# Altium schematic sheet [4] Temp_Sense.SchDoc
size A4
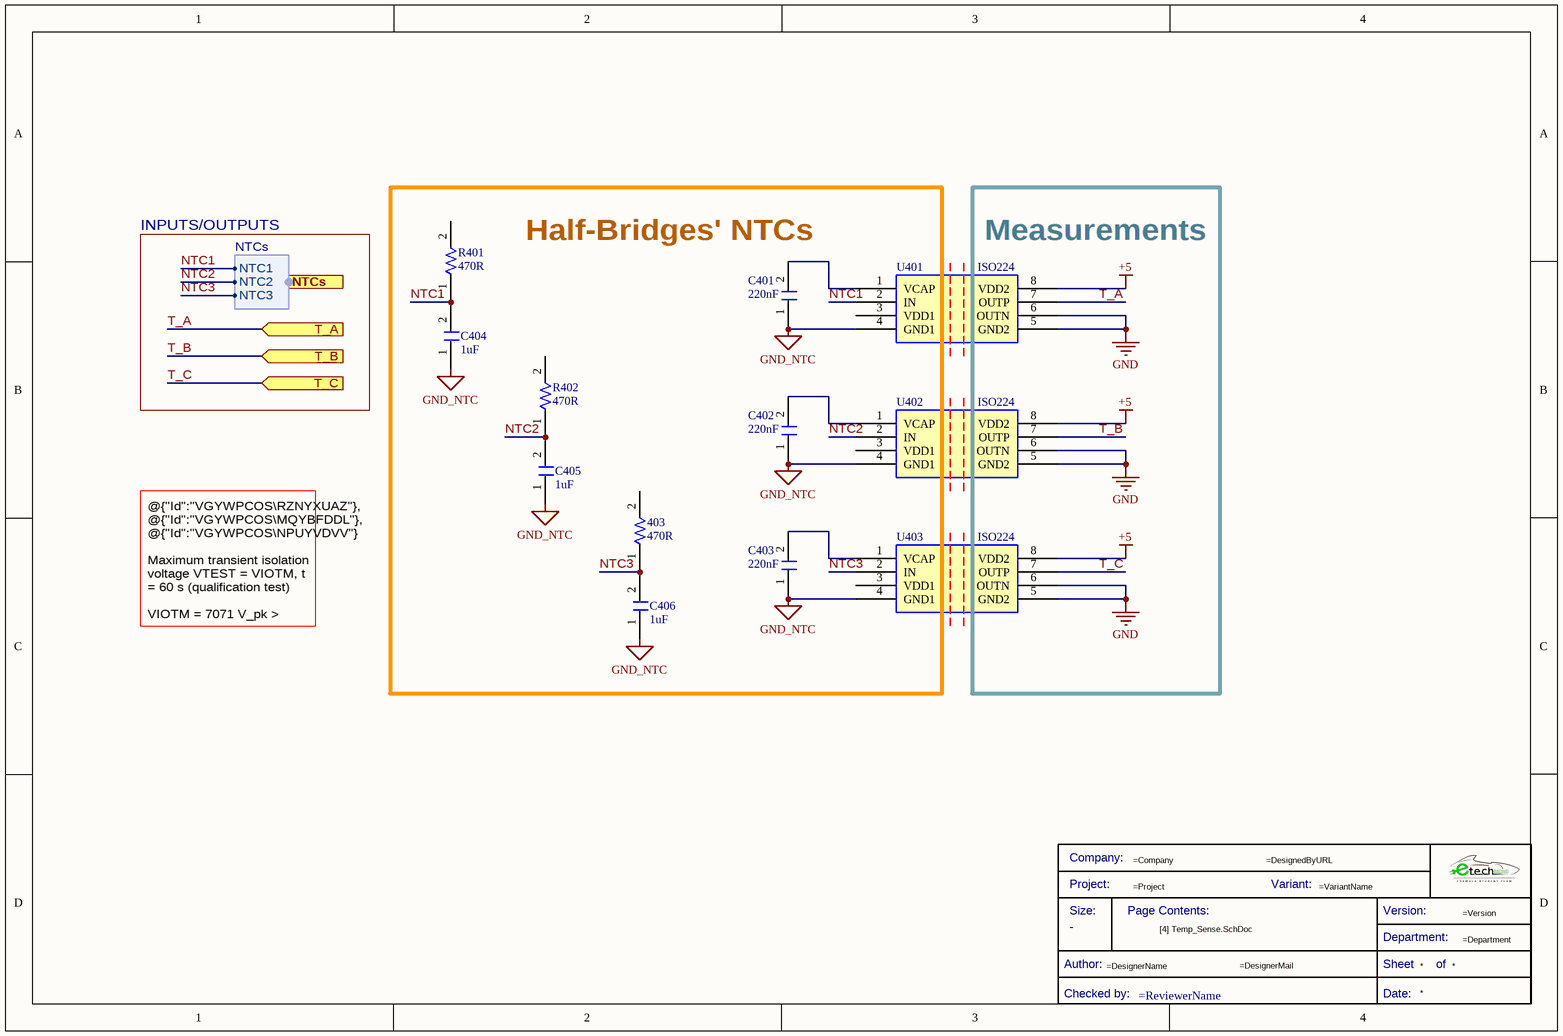
[diagram p0: [4] Temp_Sense.SchDoc]

## Parts
403  Resistance: 470R  [R0805FTK]  (hidden comment: CR0805-FX-4700GLF)
*?  Title Block_template  (value not drawn)  (graphical)
C401  Capacitance: 220nF  [C0805FNPC-W]  (hidden comment: 885012208058)
C402  Capacitance: 220nF  [C0805FNPC-W]  (hidden comment: 885012208058)
C403  Capacitance: 220nF  [C0805FNPC-W]  (hidden comment: 885012208058)
C404  Capacitance: 1uF  [C0805FNPC-R]  (hidden comment: 885012207103)
C405  Capacitance: 1uF  [C0805FNPC-R]  (hidden comment: 885012207103)
C406  Capacitance: 1uF  [C0805FNPC-R]  (hidden comment: 885012207103)
R401  Resistance: 470R  [R0805FTK]  (hidden comment: CR0805-FX-4700GLF)
R402  Resistance: 470R  [R0805FTK]  (hidden comment: CR0805-FX-4700GLF)
U401  ISO224
U402  ISO224
U403  ISO224

## Blocks framed on the sheet
Half-Bridges' NTCs: 403 C401-C406 R401 R402

## Ports
NTCs (harness NTCs, see Inverter_Power[3C], [1] Power_Stage[1B]), T_A (in, see Inverter_Power[3C]), T_B (in, see Inverter_Power[3C]), T_C (in, see Inverter_Power[3C])

## Harnesses
NTCs: NTC1, NTC2, NTC3

## Nets
+5: U401.8(VDD2) U402.8(VDD2) U403.8(VDD2)
GND: U401.5(GND2) U401.6(OUTN) U402.5(GND2) U402.6(OUTN) U403.5(GND2) U403.6(OUTN)
GND_NTC: C401.1 C402.1 C403.1 C404.1 C405.1 C406.1 U401.4(GND1) U402.4(GND1) U403.4(GND1)
NTC1: C404.2 R401.1 U401.2(IN) ; port NTCs.NTC1
NTC2: C405.2 R402.1 U402.2(IN) ; port NTCs.NTC2
NTC3: 403.1 C406.2 U403.2(IN) ; port NTCs.NTC3
T_A: U401.7(OUTP) ; port T_A
T_B: U402.7(OUTP) ; port T_B
T_C: U403.7(OUTP) ; port T_C
NetC401_2: C401.2 U401.1(VCAP)
NetC402_2: C402.2 U402.1(VCAP)
NetC403_2: C403.2 U403.1(VCAP)

Not connected (* = marked no-connect by the designer): 403 2; R401 2; R402 2; U401 3(VDD1); U402 3(VDD1); U403 3(VDD1)

## Notes on the sheet
- INPUTS/OUTPUTS
- (near U401) Measurements
- @{"Id":"VGYWPCOS\RZNYXUAZ"}, @{"Id":"VGYWPCOS\MQYBFDDL"}, @{"Id":"VGYWPCOS\NPUYVDVV"}
  Maximum transient isolation voltage VTEST = VIOTM, t = 60 s (qualification test)
  VIOTM = 7071 V_pk > 3*V_max = 1.8 kV
- (in symbol Title Block_template) Company:; Project:; Variant:; Size:; Page Contents:; Version:; Department:; Author:; Sheet; of; Checked by:; Date:

## Library data of the parts
403 R401 R402 = R470-0805FTK: Res Thick Film 0805 470 Ohm 1% 1/8W ±100ppm/°C Molded SMD SMD Paper Tape on Plastic Reel; Manufacturer 1: Bourns; Power Rating: 125mW; Voltage Rating: 150V; .Creator: DR; Supplier 1: Arrow Electronics; Manufacturer Part Number 1: CR0805-FX-4700GLF; RoHS: Yes; Category: Chip SMD Resistors; Stock 1: 12623; Pricing 1: 1=0,00990, 10=0,00980, 25=0,00950, 50=0,00940, 100=0,00930, 250=0,00920, 500=0,00910, 1000=0,00890, 3000=0,00870, 6000=0,00860 (USD); Mount: Surface Mount; Case/Package: 0805; Number of Pins: 2; Case Code (Imperial): 0805; Case Code (Metric): 2012; Contact Plating: Tin; Min Operating Temperature: -55°C; Max Operating Temperature: 155°C; Packaging: Tape and Reel; Tolerance: 1%; Resistor Type: Thick Film; Termination: SMD/SMT; Temperature Coefficient: 100ppm/°C; Voltage Rating (DC): 150V; Features: Moisture Resistant; Series: CR0805; Max Power Dissipation: 125mW; Number of Terminations: 2; Resistance Tolerance: 1%; Construction: Rectangular; Technology: THICK FILM; Length: 2mm; Height: 0.5mm; Depth: 1.25mm; Thickness: 508um; Radiation Hardening: No; REACH SVHC: No SVHC; Military Standard: Not; ComponentLink1URL: https://datasheet.ciiva.com/11808/0900766b80fcdb72-11808686.pdf?src-supplier=RSComponents; ComponentLink1Description: https://datasheet.ciiva.com/11808/0900766b80fcdb72-11808686.pdf?src-supplier=RSComponents; ComponentLink2URL: https://datasheet.ciiva.com/7985/1856384-7985880.pdf?src-supplier=Element14; ComponentLink2Description: https://datasheet.ciiva.com/7985/1856384-7985880.pdf?src-supplier=Element14; ComponentLink3URL: https://datasheet.ciiva.com/22693/1902866-22693247.pdf?src-supplier=Element14; ComponentLink3Description: https://datasheet.ciiva.com/22693/1902866-22693247.pdf?src-supplier=Element14; ComponentLink4URL: https://datasheet.ciiva.com/5541/chpreztr-5541930.pdf?src-supplier=Mouser; ComponentLink4Description: https://datasheet.ciiva.com/5541/chpreztr-5541930.pdf?src-supplier=Mouser; Supplier Part Number 1: CR0805-FX-4700GLF
*? = Title Block_template: Standard Title Block; .Creator: GP; Category: Title Block; .PCBcheck: GP; .SCHcheck: GP; Checked by:: =ReviewerName; Size: -
C401-C403 = C0.22u-0805FNPC-X5R: Cap Ceramic 0.22uF 50V X5R 10% Pad SMD 0805 85C Low ESR Automotive T/R; Manufacturer: Taiyo Yuden; Manufacturer Part Number: UMK212BJ224KGHT; .Creator: DR; Category: Capacitor; ComponentLink1Description: Datasheet; ComponentLink1URL: https://eu.mouser.com/datasheet/2/396/taiyo_yuden_12132018_mlcc11_hq_e-1510082.pdf; ComponentLink2Description: Where buy it; ComponentLink2URL: https://eu.mouser.com/ProductDetail/Taiyo-Yuden/UMK212BJ224KGHT?qs=CNQs48zzdnpf%2FbZJTfp33Q%3D%3D; Supplier 1: Digi-Key; RoHS: Yes; Stock 1: 900; Pricing 1: 1=0,20000, 10=0,13700, 50=0,08220, 100=0,06950, 500=0,04754, 1000=0,04206 (USD); Mount: Surface Mount; Case/Package: 0805; Case Code (Metric): 2012; Case Code (Imperial): 0805; Min Operating Temperature: -55°C; Max Operating Temperature: 85°C; Package Quantity: 3000; Packaging: Tape and Reel; Tolerance: 10%; Voltage Rating: 50V; Voltage Rating (DC): 50V; Dielectric: X5R; Termination: SMD/SMT; Length: 0.079inch; Width: 0.049inch; Height: 1.25mm; Thickness: 0.053inch; Ratings: AEC-Q200; Lead Free: Lead Free; Halogen Free: Halogen Free; RoHS Compliant: Yes; Supplier Part Number 1: 587-3514-1-ND
C404-C406 = C1u-50V-0805FNPC-X7R: Multilayer Ceramic Capacitor, Wcap-Csgp Series, 1 F, 10%, X7R, 50 V, 0805 [2012 Metric] Rohs Compliant: Yes; Manufacturer 1: Wurth Electronics; Voltage Rating: 50V; .Creator: GP; Supplier 1: RSComponents; Manufacturer Part Number 1: 885012207103; RoHS: Yes; Category: Ceramic Capacitors; Stock 1: 5100; Pricing 1: 50=0,27200, 250=0,25300, 500=0,22800, 1250=0,20100, 2500=0,17100 (GBP); Mount: Surface Mount; Case/Package: 0805; Case Code (Metric): 2012; Case Code (Imperial): 0805; Min Operating Temperature: -55°C; Max Operating Temperature: 85°C; Packaging: Cut Tape; Dielectric: X7R; Tolerance: 10%; Voltage Rating (DC): 50V; Length: 0.079inch; Width: 0.049inch; Thickness: 0.053inch; REACH SVHC: Unknown; RoHS Compliant: Yes; ComponentLink1URL: http://www.farnell.com/datasheets/1958501.pdf?src-supplier=Farnell; ComponentLink1Description: http://www.farnell.com/datasheets/1958501.pdf?src-supplier=Farnell; ComponentLink2URL: http://www.farnell.com/datasheets/1958501.pdf?src-supplier=Element14; ComponentLink2Description: http://www.farnell.com/datasheets/1958501.pdf?src-supplier=Element14; ComponentLink3URL: https://katalog.we-online.de/pbs/datasheet/885012107003.pdf?src-supplier=Digi-Key; ComponentLink3Description: https://katalog.we-online.de/pbs/datasheet/885012107003.pdf?src-supplier=Digi-Key; ComponentLink4URL: http://www.farnell.com/datasheets/1958501.pdf?src-supplier=Newark; ComponentLink4Description: http://www.farnell.com/datasheets/1958501.pdf?src-supplier=Newark; Supplier Part Number 1: 1813523
U401-U403 = ISO224: Reinforced isolated amplifier for voltage sensing with ±12-V input 8-SOIC -55 to 125; Manufacturer 1: Texas Instruments; Manufacturer Part Number 1: ISO224ADWVR; Supplier 1: Mouser; RoHS: Yes; Category: Amplifiers - Op Amps, Buffer, Instrumentation; Stock 1: 3377; Pricing 1: 1=13,32, 10=12,25, 50=11,74, 100=10,35, 1000=8,44, 10000=8,44 (USD); ComponentLink1URL: http://www.ti.com/general/docs/suppproductinfo.tsp?distId=10&amp;gotoUrl=http%3A%2F%2Fwww.ti.com%2Flit%2Fgpn%2Fiso224&src-supplier=Digi-Key; ComponentLink1Description: http://www.ti.com/general/docs/suppproductinfo.tsp?distId=10&amp;gotoUrl=http%3A%2F%2Fwww.ti.com%2Flit%2Fgpn%2Fiso224&src-supplier=Digi-Key; Supplier Part Number 1: 595-ISO224ADWVR